# Altium schematic sheet 11_Supervisión.SchDoc
size A4; SheetNumber: 2; SheetTotal: 10
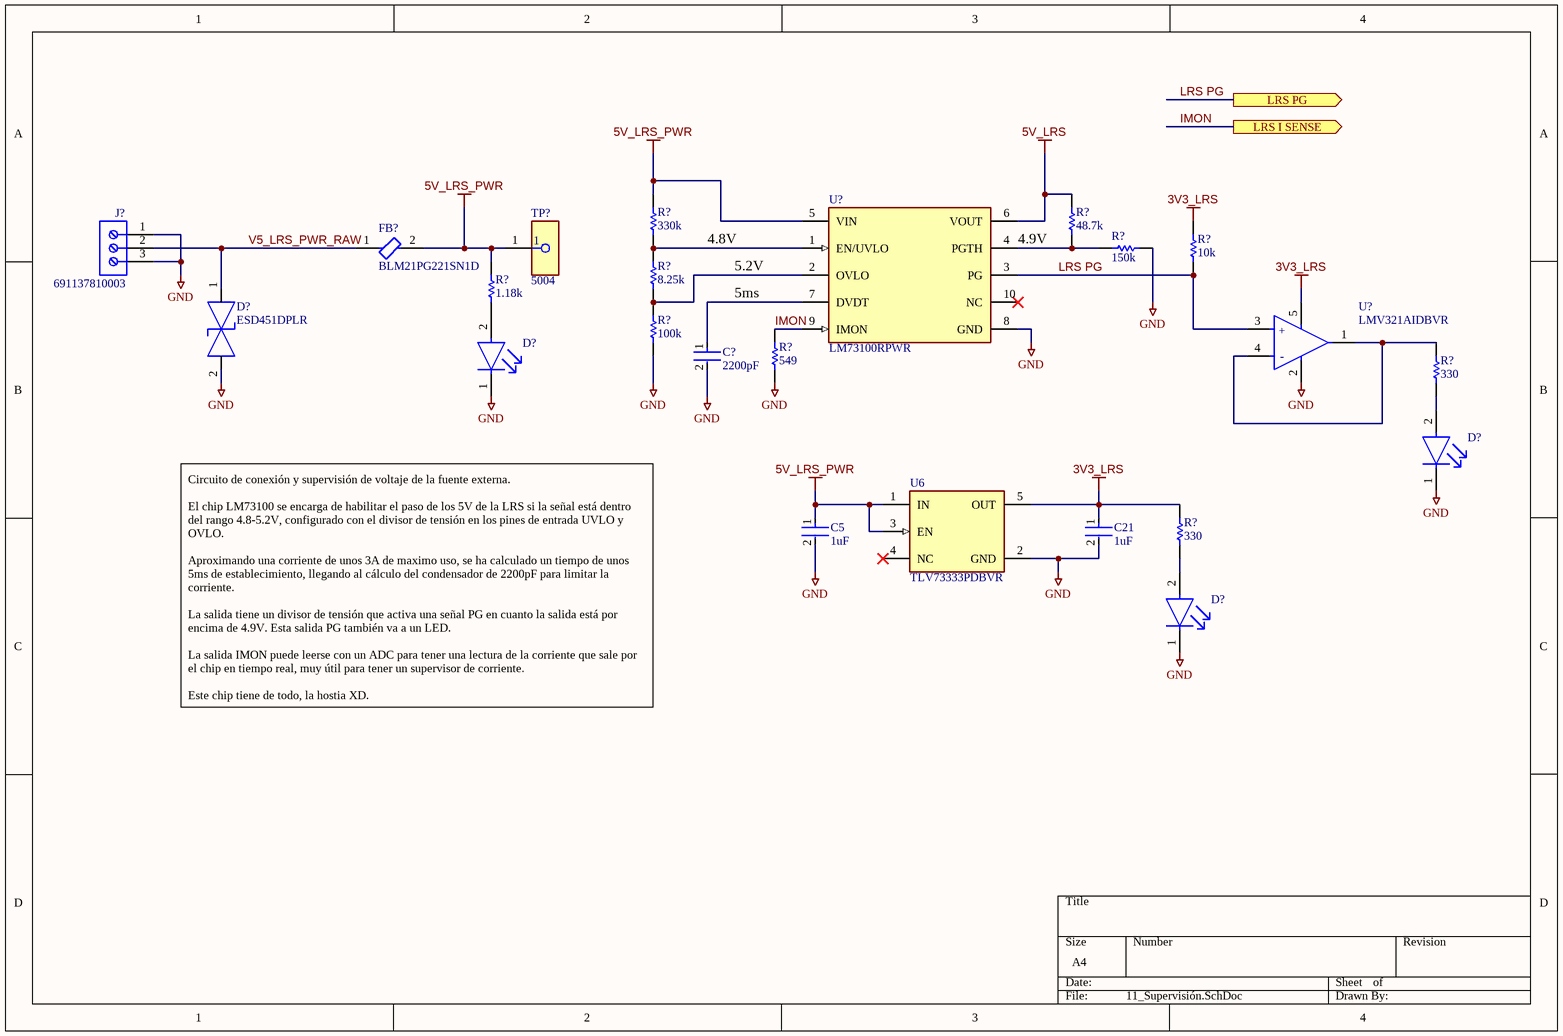
[diagram p0: 11_Supervisión.SchDoc]

## Parts
(Parts that share a designator on the sheet are numbered #1, #2 ... from top to bottom, then left to right.)
C5  1uF  [FP-C0402C-BB-IPC_B]
C21  1uF  [FP-C0402C-BB-IPC_B]
C?  2200pF  [FP-AC0402-0_5-MFG]
D?#1  ESD451DPLR  [FP-DPL0002A_MFG]
D?#2  APHD1608LZGCK  [FP-APHD1608LZGCK-MFG]  (value not drawn)
D?#3  APHD1608LZGCK  [FP-APHD1608LZGCK-MFG]  (value not drawn)
D?#4  APHD1608LZGCK  [FP-APHD1608LZGCK-MFG]  (value not drawn)
FB?  BLM21PG221SN1D  [FP-BLM21-0_2-t0_85-e0_5-IPC_B]
J?  691137810003  [691137810003]
R?#1  330k  [RESC1005X40X25ML05T05]
R?#2  48.7k  [RESC1005X40X25ML05T05]
R?#3  150k  [RESC1005X40X25NL05T05]
R?#4  10k  [RESC1005X40X25ML05T05]
R?#5  8.25k  [RESC1005X40X25LL05T05]
R?#6  1.18k  [RESC1005X40X25NL05T05]
R?#7  100k  [RESC1005X40X25LL05T05]
R?#8  549  [RESC1005X40X25LL05T05]
R?#9  330  [RESC1005X40X25NL10T10]
R?#10  330  [RESC1005X40X25NL10T10]
TP?  5004  [FP-5004-MFG]
U6  TLV73333PDBVR  [FP-DBV0005A-MFG]
U?#1  LM73100RPWR  [FP-RPW0010A-MFG]
U?#2  LMV321AIDBVR  [FP-DBV0005A-MFG]

## Ports
LRS I SENSE (out), LRS PG (out)

## Nets
3V3_LRS: C21.1 R?#4.2 R?#10.2 U6.5(OUT) U?#2.5(V+)
5V_LRS: R?#2.2 U?#1.6(VOUT)
5V_LRS_PWR: C5.1 FB?.2 R?#1.2 R?#6.2 TP?.1 U6.1(IN) U6.3(EN) U?#1.5(VIN)
GND: C5.2 C21.2 C?.2 D?#1.2(2_IO) D?#2.1(C) D?#3.1(C) D?#4.1(C) J?.1 J?.3 R?#3.2 R?#7.2 R?#8.1 U6.2(GND) U?#1.8(GND) U?#2.2(V-)
IMON: R?#8.2 U?#1.9(IMON) ; port LRS I SENSE
LRS PG: R?#4.1 U?#1.3(PG) U?#2.3(+IN) ; port LRS PG
V5_LRS_PWR_RAW: D?#1.1(1_IO) FB?.1 J?.2
NetC?_1: C?.1 U?#1.7(DVDT)
NetD?#2_2: D?#2.2(A) R?#6.1
NetD?#3_2: D?#3.2(A) R?#9.1
NetD?#4_2: D?#4.2(A) R?#10.1
NetR?#1_1: R?#1.1 R?#5.2 U?#1.1(EN/UVLO)
NetR?#2_1: R?#2.1 R?#3.1 U?#1.4(PGTH)
NetR?#5_1: R?#5.1 R?#7.1 U?#1.2(OVLO)
NetR?#9_2: R?#9.2 U?#2.1(OUT) U?#2.4(-IN)

Not connected (* = marked no-connect by the designer): U6 4(NC)*; U?#1 10(NC)*

## Notes on the sheet
- 4.8V
- 4.9V
- 5.2V
- 5ms
- Circuito de conexión y supervisión de voltaje de la fuente externa.
  El chip LM73100 se encarga de habilitar el paso de los 5V de la LRS si la señal está dentro del rango 4.8-5.2V, configurado con el divisor de tensión en los pines de entrada UVLO y OVLO.
  Aproximando una corriente de unos 3A de maximo uso, se ha calculado un tiempo de unos 5ms de establecimiento, llegando al cálculo del condensador de 2200pF para limitar la corriente.
  La salida tiene un divisor de tensión que activa una señal PG en cuanto la salida está por encima de 4.9V. Esta salida PG también va a un LED.
  La salida IMON puede leerse con un ADC para tener una lectura de la corriente que sale por el chip en tiempo real, muy útil para tener un supervisor de corriente.
  Este chip tiene de todo, la hostia XD.
- (in symbol CMP-04895-000333-1) +; -

## Library data of the parts
C5 C21 = CMP-03020-034679-1: CAP CER 1UF 16V X5R 0402; Dielectric Material: Ceramic; Tolerance: 10%; RoHS Compliant: Yes; Voltage Rating (DC): 16V; Voltage Rating: 16V; Max Operating Temperature: 85°C; Packaging: Cut Tape; Width: 0.02inch; Dielectric: X5R; Lead Free: Lead Free; Min Operating Temperature: -55°C; Mount: Surface Mount; Case/Package: 0402; Thickness: 0.022inch; REACH SVHC: No SVHC; Length: 0.039inch; Case Code (Metric): 1005; Case Code (Imperial): 0402; Capacitance: 1uF
C? = CMP-03422-000165-1: CAP CER 2200PF 16V X7R 0402; Manufacturer Part Number: AC0402KRX7R7BB222; Manufacturer: Yageo; Capacitance: 2.2 nF; Temperature Coefficient: ±15%; Automotive Grade: Grade 1; Value: 2.2 nF; Material: Ceramic; Tolerance: 0.1; Digikey Description: CAP CER 2200PF 16V X7R 0402; Temperature: -55°C to +125°C; Device Class L1: Passive Components; Device Class L3: Ceramic Capacitors; Temperature Range High: +125°C; Temperature Characteristic: X7R; Lead Free: Yes; Device Class L2: Capacitors; Voltage Rating: 16 V; Package: AC0402-0.5; Temperature Range Low: -55°C; Footprint Url: http://www.yageo.com/exep/pages/download/literatures/UPY-C_GEN_24.pdf; ComponentLink2Description: Datasheet; Automotive: Yes; Mouser Description: Cap Ceramic 0.0022uF 16V X7R 10% SMD 0402 125°C Paper T/R; Octopart: https://octopart.com/ac0402krx7r7bb222-yageo-76900921; Height: 0.55mm; ComponentLink2URL: http://www.yageo.com/documents/recent/UPY-AC_NP0X7R_16V-to-630V_12.pdf; Category: Cap; RoHS: TRUE; Ipc Land Pattern Name: CAPC10050X50
D?#1 = CMP-00370-140306676-1: 0.5-pF, 5.5-V, 30-KV bidirectional ESD protection device in 0201 package 2-X2SON -40 to 125; Manufacturer Lifecycle Status: ACTIVE; Thickness: 300µm; ComponentLink3URL: https://www.ti.com/lit/ds/symlink/tpd1e04u04.pdf?ts=1701165483995&ref_url=https%253A%252F%252Fwww.ti.com%252Fproduct%252FTPD1E04U04%252Fpart-details%252FTPD1E04U04DPLR; ComponentLink3Description: Manufacturer's Package Drawing; Lifecycle Status: Production; ComponentLink1URL: http://ti.com; ComponentLink2Description: HelpURL; Width: 300µm; ComponentLink2URL: https://www.ti.com/lit/ds/symlink/esd451.pdf; Height: 320µm; Number of Pins: 2; ComponentLink1Description: Manufacturer's Website; Length: 600µm
D?#2-D?#4 = CMP-44529-000045-1: LED GREEN CLEAR 1608 SMD; Test Current: 2mA; Dominant Wavelength: 525nm; Lens Color: Colorless; Luminous Intensity: 180mcd; Viewing Angle: 100°; Forward Voltage: 2.65V; Lens Size: 0.7mm; Lens Style: Round; Mount: Surface Mount; Packaging: Tape and Reel; Lens Transparency: Clear; Height: 0.75mm; Case/Package: 0603; Length: 1.6mm; Case Code (Metric): 1608; Width: 0.8mm; Color: Green; Case Code (Imperial): 0603
FB? = CMP-0686-00610-3: Chip Ferrite Bead, 0805, 220Ω @ 100MHz, 0.045Ω, 25%, 2A; Number of Circuits: 1; Shielding: Unshielded; DC Resistance (DCR): 45mR; Impedance: 220R; Radiation Hardening: No; Material: Ferrite; Frequency: 100MHz; Width: 1.25mm; DC Current: 2A; Max DC Current: 2A; Number of Lines: 1; Package Quantity: 1; Case Code (Metric): 2012; Current Rating: 2A; Case/Package: 0805; Current: 2A; Military Standard: Not; Core Material: Ferrite; Depth: 1.25mm; Contact Plating: Tin; DC Resistance-Max: 45mR; Max Operating Temperature: 125°C; Length: 2mm; Max Current Rating: 2A; REACH SVHC: No SVHC; Termination: SMD/SMT; Min Operating Temperature: -55°C; Series: BLM21P; Test Frequency: 100MHz; Tolerance: 25%; Number of Pins: 2; RoHS Compliant: Yes; Height: 0.85mm; Packaging: Tape and Reel; Lead Free: Lead Free; Case Code (Imperial): 0805
J? = CMP-1502-03382-3: 10.00 mm Terminal Block, Horizontal Entr
R?#1 = CMP-1011-00134-2: Part Number: ERJ-2GEJ334X; Manufacturer: Panasonic
R?#2 = CMP-2002-00962-1: Part Number: ERJ-2RKF4872X; Manufacturer: Panasonic
R?#3 = CMP-2002-00459-1: Part Number: ERJ-2GEJ154X; Manufacturer: Panasonic
R?#4 = CMP-2002-00601-1: Manufacturer: Panasonic; Part Number: ERJ-2RHD1002X
R?#5 = CMP-2002-01079-1: Part Number: ERJ-2RKF8251X; Manufacturer: Panasonic
R?#6 = CMP-1011-00517-2: Part Number: ERJ-2RKF1181X; Manufacturer: Panasonic
R?#7 = CMP-2002-00602-1: Manufacturer: Panasonic; Part Number: ERJ-2RHD1003X
R?#8 = CMP-2002-00989-1: Manufacturer: Panasonic; Part Number: ERJ-2RKF5490X
R?#9 R?#10 = CMP-2002-05883-1: Manufacturer: Panasonic; Part Number: ERA2AEB331X
TP? = CMP-2000-05575-2: PC TEST POINT MINIATURE YELLOW; Manufacturer: Keystone; Number Of Contacts: 1; Is Female: yes; Device Class L1: Connectors; Manufacturer Part Number: 5004; Digikey Description: PC TEST POINT MINIATURE YELLOW; ComponentLink2URL: https://www.keyelco.com/product-pdf.cfm?p=1313; Lead Free: Yes; ComponentLink2Description: Datasheet; Category: Conn; Height: 4.72mm; Octopart: https://octopart.com/5004-keystone-28591; Mouser Description: TEST POINT PC MINI .040"D YELLOW; Device Class L3: unset; Contact Material: Silver; Package: 5004; Automotive: No; Device Class L2: unset; RoHS: TRUE
U6 = CMP-04917-000053-1: IC REG LINEAR 3.3V 300MA SOT23-5; Manufacturer: Texas Instruments; Max Junction Temp: +125°C; Accuracy Percentage: 1%; Min Supply Voltage: 1.4V; Number Of Outputs: 1; Dropout Voltage: 125mV; Nominal Supply Current: 34uA; Max Supply Voltage: 5.5V; Output Type: Fixed; Standoff Height: 0mm; Digikey Description: IC REG LINEAR 3.3V 300MA SOT23-5; Manufacturer Part Number: TLV73333PDBVR; Temperature Range High: +125°C; Temperature: -40°C to +125°C; Output Current: 300mA; Mouser Description: LDO Voltage Regulators Capacitr-Free 300-mA 5-SOT-23 -40 to 125; Automotive: No; Height: 1.45mm; Device Class L3: Voltage Regulators - Linear; ComponentLink2Description: Datasheet; Device Class L1: Integrated Circuits (ICs); ComponentLink2URL: http://www.ti.com/lit/ds/symlink/tlv733p.pdf; Octopart: https://octopart.com/tlv73333pdbvr-texas+instruments-51080890; Temperature Range Low: -40°C; RoHS: TRUE; Lead Free: Yes; Output Voltage: 3.3V; Package: DBV0005A; Device Class L2: Power Management ICs; Category: IC
U?#1 = CMP-04910-000122-1: 2.7-V TO 23-V, 5.5-A IDEAL DIODE; RoHS Compliant: Yes
U?#2 = CMP-04895-000333-1: IC OPAMP GP 1 CIRCUIT SOT23-5; Input Bias Current: 10pA; Output Current per Channel: 40mA; Gain Bandwidth Product: 1MHz; Input Offset Voltage (Vos): 1mV; Number of Channels: 1; Operating Supply Current: 80uA; Slew Rate: 1.7V/µs; Mount: Surface Mount; Min Operating Temperature: -40°C; Packaging: Cut Tape; Case/Package: SOT-23-5; RoHS Compliant: Yes; Max Operating Temperature: 125°C; Number of Circuits: 1